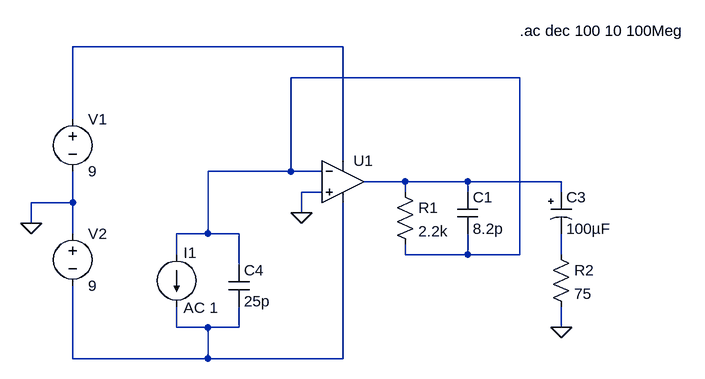
[diagram p0: schematic receiver.asc]
receiver.asc, the LTspice schematic file:
Version 4.1
SHEET 1 992 744
WIRE 448 -32 32 -32
WIRE 720 16 368 16
WIRE 32 80 32 -32
WIRE 448 144 448 -32
WIRE 368 160 368 16
WIRE 368 160 240 160
WIRE 416 160 368 160
WIRE 544 176 480 176
WIRE 640 176 544 176
WIRE 784 176 640 176
WIRE 416 192 384 192
WIRE 544 192 544 176
WIRE 640 192 640 176
WIRE 784 192 784 176
WIRE 32 208 32 160
WIRE 32 208 -32 208
WIRE 384 224 384 192
WIRE -32 240 -32 208
WIRE 32 256 32 208
WIRE 240 256 240 160
WIRE 240 256 192 256
WIRE 288 256 240 256
WIRE 192 288 192 256
WIRE 544 288 544 272
WIRE 640 288 640 256
WIRE 640 288 544 288
WIRE 720 288 720 16
WIRE 720 288 640 288
WIRE 784 288 784 256
WIRE 288 304 288 256
WIRE 192 400 192 368
WIRE 240 400 192 400
WIRE 288 400 288 368
WIRE 288 400 240 400
WIRE 784 400 784 368
WIRE 32 448 32 336
WIRE 240 448 240 400
WIRE 240 448 32 448
WIRE 448 448 448 208
WIRE 448 448 240 448
FLAG 384 224 0
FLAG -32 240 0
FLAG 784 400 0
SYMBOL voltage 32 64 R0
WINDOW 123 0 0 Left 0
WINDOW 39 0 0 Left 0
SYMATTR InstName V1
SYMATTR Value 9
SYMBOL voltage 32 240 R0
WINDOW 123 0 0 Left 0
WINDOW 39 0 0 Left 0
SYMATTR InstName V2
SYMATTR Value 9
SYMBOL res 528 176 R0
SYMATTR InstName R1
SYMATTR Value 2.2k
SYMBOL cap 624 192 R0
SYMATTR InstName C1
SYMATTR Value 8.2p
SYMBOL polcap 768 192 R0
SYMATTR InstName C3
SYMATTR Value 100µF
SYMBOL res 768 272 R0
SYMATTR InstName R2
SYMATTR Value 75
SYMBOL cap 272 304 R0
SYMATTR InstName C4
SYMATTR Value 25p
SYMBOL OpAmps\\UniversalOpAmp 448 176 R0
SYMATTR InstName U1
SYMBOL current 192 288 R0
WINDOW 0 11 -3 Left 2
WINDOW 123 11 82 Left 2
WINDOW 39 0 0 Left 0
SYMATTR InstName I1
SYMATTR Value ""
SYMATTR Value2 AC 1
TEXT 720 -56 Left 2 !.ac dec 100 10 100Meg

The netlist it stands for:
* receiver.asc
V1 N001 0 9
V2 0 N005 9
R1 N003 N002 2.2k
C1 N003 N002 8.2p
C3 N003 N004 100µF
R2 N004 0 75
C4 N002 N005 25p
X§U1 0 N002 N001 N005 N003 level1 Avol=1Meg GBW=10Meg Vos=0 En=0 Enk=0 In=0 Ink=0 Rin=500Meg  ; pins In+ In- V+ V- OUT
I1 N002 N005 AC 1
.ac dec 100 10 100Meg
.lib UniversalOpAmp1.lib
.backanno
.end